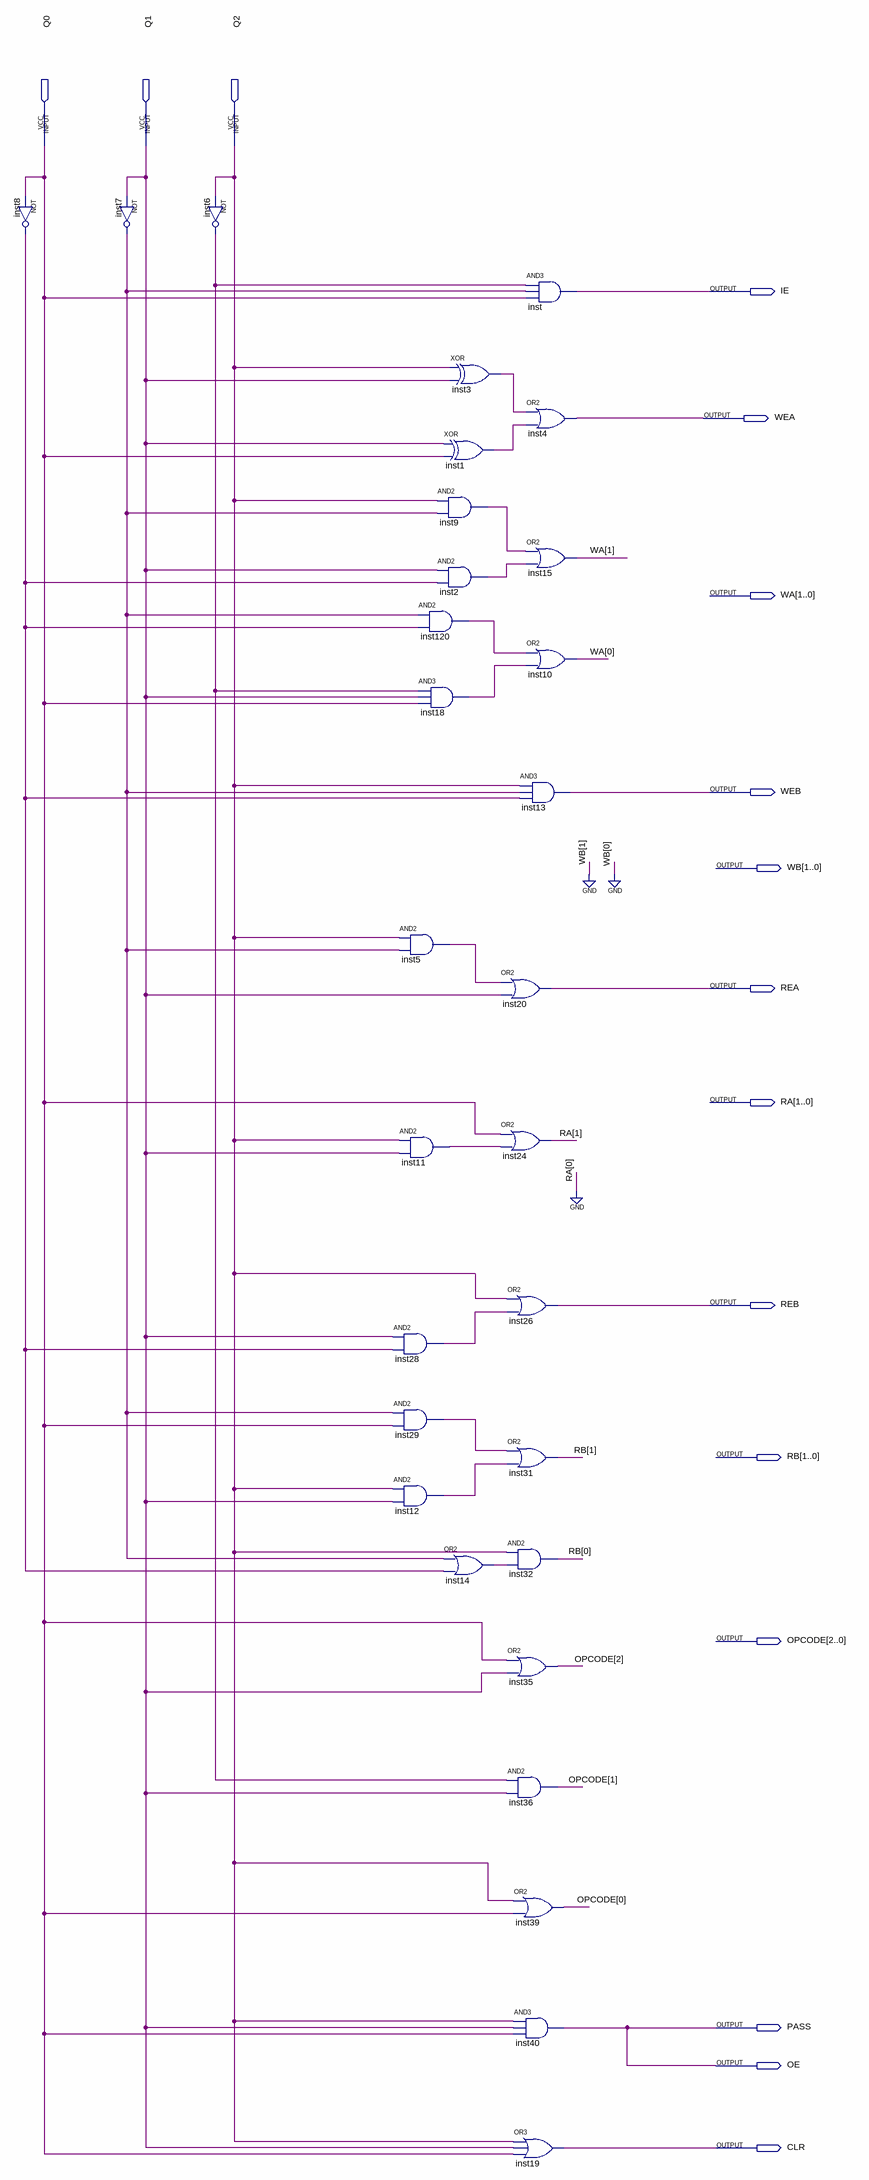
[diagram p0: schematic sheet]
// Quartus schematic control.bdf as structural Verilog: 30 symbols, 16 pins
module control (
  input  Q0,
  input  Q1,
  input  Q2,
  output IE,
  output WEA,
  output [1:0] WA,
  output WEB,
  output [1:0] WB,
  output REA,
  output [1:0] RA,
  output REB,
  output [1:0] RB,
  output [2:0] OPCODE,
  output PASS,
  output OE,
  output CLR
);

  wire inst1_out, inst2_out, inst3_out, inst5_out, inst6_out, inst7_out, inst8_out, inst9_out, inst11_out,
       inst12_out, inst14_out, inst18_out, inst28_out, inst29_out, inst120_out;

  not inst8 (inst8_out, Q0);
  not inst7 (inst7_out, Q1);
  not inst6 (inst6_out, Q2);
  and inst5 (inst5_out, Q2, inst7_out);
  and inst11 (inst11_out, Q2, Q1);
  and inst28 (inst28_out, Q1, inst8_out);
  and inst29 (inst29_out, inst7_out, Q0);
  and inst12 (inst12_out, Q2, Q1);
  xor inst3 (inst3_out, Q2, Q1);
  xor inst1 (inst1_out, Q1, Q0);
  and inst9 (inst9_out, Q2, inst7_out);
  and inst2 (inst2_out, Q1, inst8_out);
  and inst120 (inst120_out, inst7_out, inst8_out);
  and inst18 (inst18_out, inst6_out, Q1, Q0);
  or inst14 (inst14_out, inst7_out, inst8_out);
  or inst20 (REA, inst5_out, Q1);
  or inst24 (RA[1], Q0, inst11_out);
  or inst26 (REB, Q2, inst28_out);
  or inst31 (RB[1], inst29_out, inst12_out);
  and inst32 (RB[0], Q2, inst14_out);
  or inst35 (OPCODE[2], Q0, Q1);
  and inst36 (OPCODE[1], inst6_out, Q1);
  or inst39 (OPCODE[0], Q2, Q0);
  and inst40 (OE, Q2, Q1, Q0);
  or inst19 (CLR, Q2, Q1, Q0);
  and inst (IE, inst6_out, inst7_out, Q0);
  or inst4 (WEA, inst3_out, inst1_out);
  or inst15 (WA[1], inst9_out, inst2_out);
  or inst10 (WA[0], inst120_out, inst18_out);
  and inst13 (WEB, Q2, inst7_out, inst8_out);

  assign PASS = OE;
  assign RA[0] = 1'b0;
  assign WB = 2'b00;
endmodule
